# EasyEDA Pro project E-SportsV0.2-2.epro, schematic Schematic1
Board Name: Board1; Create Date: 2025-06-24; Page Name: P1; Project Name: E-SportsV0.2; Schematic Name: Schematic1; Update Date: 2025-06-26; Company: 嘉立创EDA; Page Size: A4; Version: V1.0
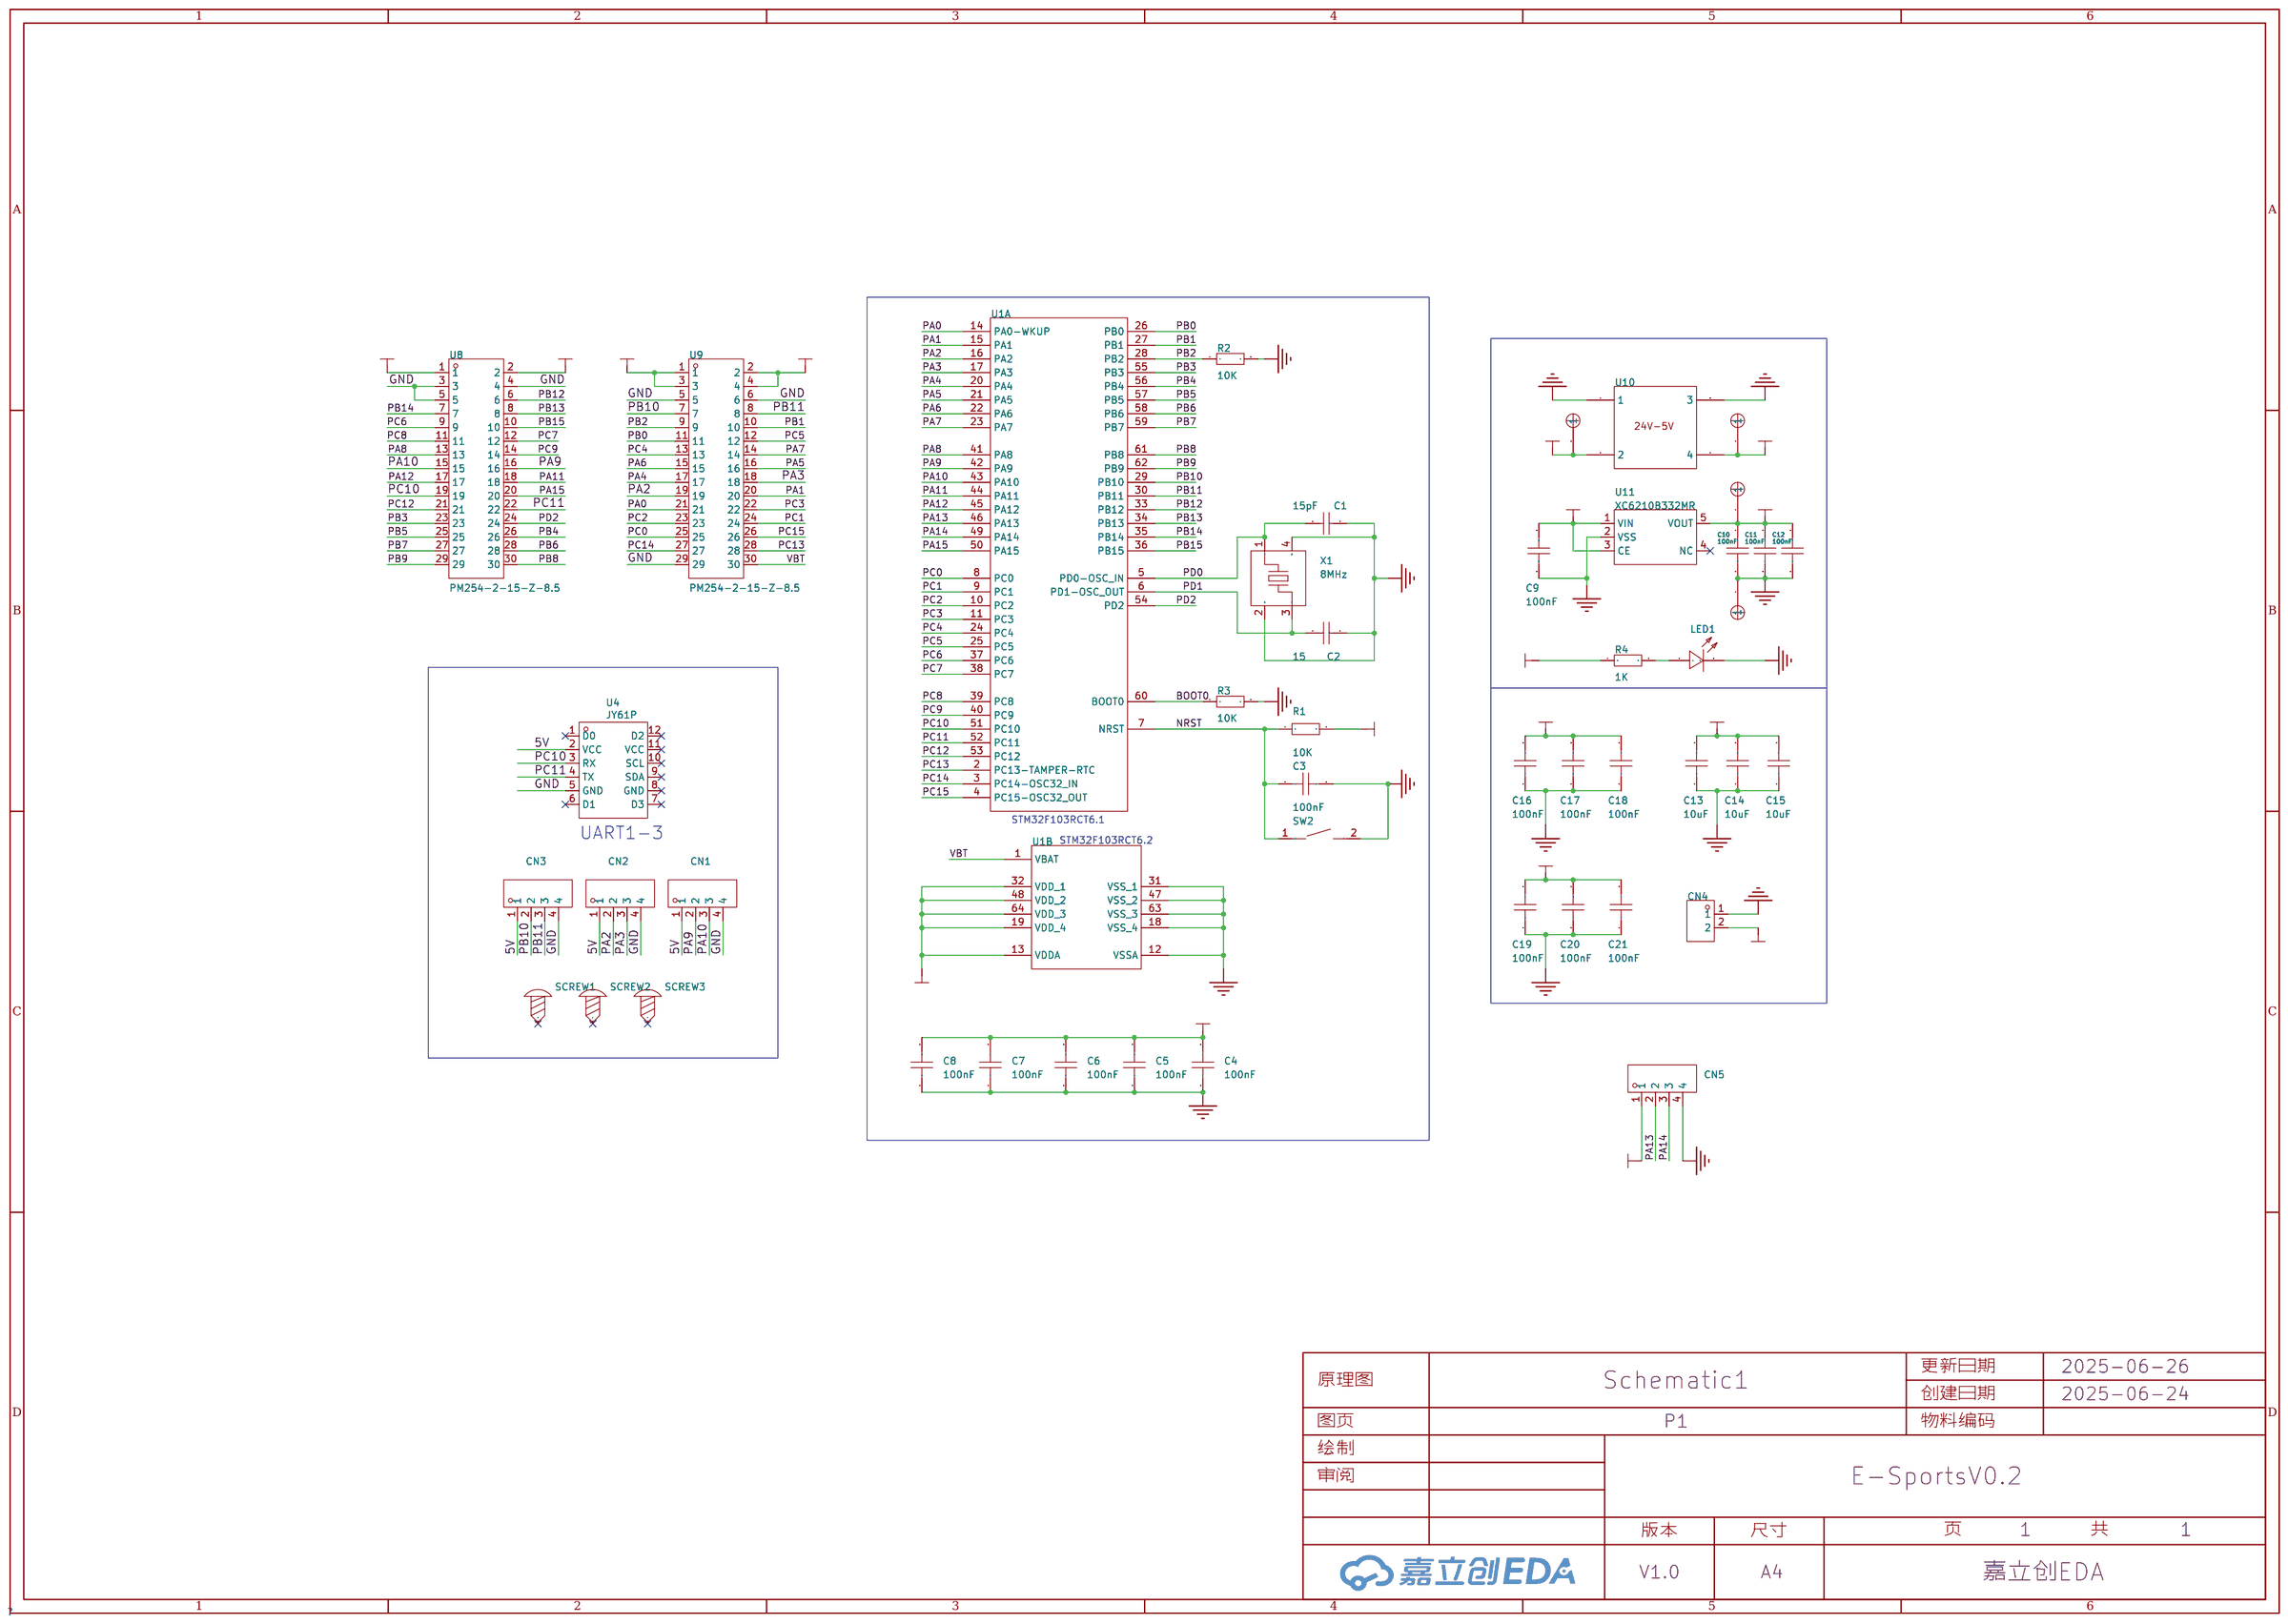
[diagram p2: schematic sheet]

## Parts
C1  15pF  [C0603]
C2  15  [C0603]
C3  100nF  [C0603]
C4  100nF  [C0603]
C5  100nF  [C0603]
C6  100nF  [C0603]
C7  100nF  [C0603]
C8  100nF  [C0603]
C9  100nF  [C0603]
C10  100nF  [C0603]
C11  100nF  [C0603]
C12  100nF  [C0603]
C13  10uF  [C0805]
C14  10uF  [C0805]
C15  10uF  [C0805]
C16  100nF  [C0603]
C17  100nF  [C0603]
C18  100nF  [C0603]
C19  100nF  [C0603]
C20  100nF  [C0603]
C21  100nF  [C0603]
CN1  ZX-XH2.54-4PWZ  [CONN-TH_4P-P2.50_ZX-XH2.54-4PWZ]
CN2  ZX-XH2.54-4PWZ  [CONN-TH_4P-P2.50_ZX-XH2.54-4PWZ]
CN3  ZX-XH2.54-4PWZ  [CONN-TH_4P-P2.50_ZX-XH2.54-4PWZ]
CN4  DB2ERC-3.81-2P-GN  [CONN-TH_2P-P3.81_DB2ERC-3.81-2P]
CN5  ZX-XH2.54-4PWZ  [CONN-TH_4P-P2.50_ZX-XH2.54-4PWZ]
LED1  KT-0805W  [LED0805-R-RD]
R1  10K  [R0603]
R2  10K  [R0603]
R3  10K  [R0603]
R4  1K  [R0603]
SCREW1  -  [M3螺丝]
SCREW2  -  [M3螺丝]
SCREW3  -  [M3螺丝]
SW2  TS-1088-AR02016  [SW-SMD_L3.9-W3.0-P4.45]
U1  STM32F103RCT6TR  [LQFP-64_L10.0-W10.0-P0.50-LS12.0-BL]  (sections 1,2)
U4  JY61P  [JY61P-直插]
U8  PM254-2-15-Z-8.5  [HDR-TH_30P-P2.54-V-F-R2-C15-S2.54-2]
U9  PM254-2-15-Z-8.5  [HDR-TH_30P-P2.54-V-F-R2-C15-S2.54-2]
U10  -  [DCDC]
U11  XC6210B332MR  [TSOT-23-5_L2.9-W1.6-P0.95-LS2.8-BR]
U12  -  [测试焊点]
U13  -  [测试焊点]
U14  -  [测试焊点]
U15  -  [测试焊点]
X1  8MHz  [CRYSTAL-SMD_4P-L3.2-W2.5-BL]

## Library data of the parts
C1 C2 = 0603CG300J500NT: 容值:30pF;精度:±5%;额定电压:50V;温度系数:C0G;; LCSC Part Name: 30pF ±5% 50V; Supplier Part: C1658; Manufacturer: FH(风华); Supplier Footprint: 0603; JLCPCB Part Class: 基础库; Datasheet: https://atta.szlcsc.com/upload/public/pdf/source/20200305/C486355_26A10D38EF8C2A5C37091D0039909270.pdf; Supplier: LCSC; Tolerance: ±5%; Voltage Rating: 50V; Temperature Coefficient: C0G
C3-C12 C16-C21 = CAP_0603: Supplier Footprint: 0603
C13-C15 = CL21A106KAYNNNE_C15850: 容值:10uF;精度:±10%;额定电压:25V;材质(温度系数):X5R;; LCSC Part Name: 10uF ±10% 25V; Supplier Part: C15850; Manufacturer: SAMSUNG(三星); Manufacturer Part: CL21A106KAYNNNE; Supplier Footprint: 0805; JLCPCB Part Class: 基础库; Datasheet: https://atta.szlcsc.com/upload/public/pdf/source/20160218/1457707763339.pdf; Supplier: LCSC; Tolerance: ±10%; Voltage Rated: 25V; Temperature Coefficient: X5R
CN1-CN3 = ZX-XH2.54-4PWZ: link: https://atta.szlcsc.com/upload/public/pdf/source/20230619/825E28BFFB9F3B9EEDAD896C78D625B2.pdf; Supplier: LCSC; Supplier Part: C7429643; Manufacturer: Megastar(兆星); JLCPCB Part Class: Extended Part
CN4 = DB2ERC-3.81-2P-GN: 连接器类型:板端/插座-闭口;结构:1x2P;间距:3.81mm;颜色:绿色;安装方式:弯针;排数:1;每排PIN数:2;额定电流:10A;额定电压:250V;工作温度范围:-40℃~+105℃;; LCSC Part Name: 3.81mm 1x2P 排数:1 每排P数:2; Supplier Part: C395684; Manufacturer: DORABO(地博电气); Supplier Footprint: 弯插,P=3.81mm; JLCPCB Part Class: 扩展库; Datasheet: https://atta.szlcsc.com/upload/public/pdf/source/20221115/4E217E7D538220F8720C137D6A05E519.pdf; Supplier: LCSC; Connector Type: 板端/插座-闭口; Structure: 1x2P; Pitch: 3.81mm; Color: 绿色; Mounting Style: 弯针; Number of Pins: 2P; Number of Rows: 1; Number of PINs Per Row: 2; Current Rating (Max): 10A; Voltage Rating (Max): 250V; Operating Temperature Range: -40℃~+105℃
CN5 = ZX-XH2.54-4PWZ: 插针结构:1x4P;间距:2.5mm;安装方式:弯插;参考系列:XH;总PIN数:4P;排数:1;每排PIN数:4;行距:-;额定电流:3A;触头材质:黄铜;触头镀层:锡;工作温度范围:-25℃~+85℃;; LCSC Part Name: 1x4P 间距:2.5mm 弯插 系列:XH; Supplier Part: C7429643; Manufacturer: Megastar(兆星); Supplier Footprint: 弯插,P=2.5mm; JLCPCB Part Class: 扩展库; Datasheet: https://atta.szlcsc.com/upload/public/pdf/source/20230619/8DC602C7BA46C153FF1BE89D90453879.pdf; Supplier: LCSC; Pins Structure: 1x4P; Pitch: 2.5mm; Mounting Type: 弯插; Reference Series: XH; Number of Pins: 4P; Number of Rows: 1; Number of PINs Per Row: 4; Rated Current: 3A; Contact Material: 黄铜; Contact Plating: 锡; Operating Temperature: -25℃~+85℃; Rated Voltage (Max): 250V; Plastic Material: PA66; Flame Retardant Rating: UL94V-0; Color: 白色; Z-Height of the Board: 5.9mm; X-Length of Bottom Edge on Board (Spacing Line): 12.5mm; Y-Width of Bottom Edge on Board: 7.32mm
LED1 = KT-0805W: 色温6000K左右; LCSC Part Name: 0805 白灯 高亮; Supplier Part: C34499; Manufacturer: KENTO; Supplier Footprint: 0805; JLCPCB Part Class: 基础库; Datasheet: https://atta.szlcsc.com/upload/public/pdf/source/20221124/DAA20402FFC1FB071B8B6797757426FE.pdf; Supplier: LCSC
R1-R4 = Res_0603: Supplier Footprint: 0603
SCREW1-SCREW3 = M3螺丝: Supplier Footprint: 插件
SW2 = TS-1088-AR02016: 电路结构:单刀单掷;按钮形状:圆形按钮;作用力:160gf;安装方式:立贴;开关长度:4mm;开关宽度:3mm;开关高度:2mm;带支架:不带;触点电流:50mA;额定电压(DC):12V;绝缘电阻:100MΩ;机械寿命:10万次;; LCSC Part Name: 4*3*2mm 立贴 轻触开关; Supplier Part: C720477; Manufacturer: XUNPU(讯普); Supplier Footprint: SMD; JLCPCB Part Class: 基础库; Datasheet: https://atta.szlcsc.com/upload/public/pdf/source/20200810/C720475_60D09DD6C54279ADDB2DC25100F1CC11.pdf; Supplier: LCSC; Circuit: 单刀单掷; Actuator Style: 圆形按钮; Operating Force: 160gf; Mounting Style: 立贴; Switch Length: 4mm; Switch Width: 3mm; Switch Height: 2mm; Strike Gundam: 不带; Contact Current: 50mA; Voltage Rating (DC): 12V; Insulation Resistance: 100MΩ; Actuator/Cap Color: 黑色; Pin Style: SMD接片; Mechanical Life: 10万次; Operating Temperature: -30℃~+80℃
U1 = STM32F103RCT6TR: CPU内核:ARM-M3;应用领域:-;; LCSC Part Name: 主流增强型ARM Cortex-M3 MCU，具有256 KB Flash、72 MHz CPU、电机控制、USB和CAN; Supplier Part: C39704; Manufacturer: ST(意法半导体); Supplier Footprint: LQFP-64(10x10); JLCPCB Part Class: 扩展库; Datasheet: https://atta.szlcsc.com/upload/public/pdf/source/20151012/1457707442737.pdf; Supplier: LCSC; CPU Core: ARM-M3; Program Storage Size: 256KB; Program Memory Type: FLASH; ADC (Bit): 12bit; DAC (Bit): 12bit
U4 = JY61P: Supplier: Wit-Motion
U8 U9 = PM254-2-15-Z-8.5: 插孔结构:2x15P;间距:2.54mm;行距:2.54mm;圆孔/方孔:方孔;安装类型:直插;排数:双排;总孔位数:30P;额定电流:3A;额定电压:-;插孔方向:顶部;塑高:8.5mm;触头材质:铜合金;工作温度范围:-40℃~+105℃;焊接温度(最大值):260℃@5S;; LCSC Part Name: 2x15P 间距:2.54mm 直插; Supplier Part: C2897416; Manufacturer: HCTL(华灿天禄); Supplier Footprint: 插件,P=2.54mm; JLCPCB Part Class: 扩展库; Datasheet: https://atta.szlcsc.com/upload/public/pdf/source/20230609/3D36CA2C1BFC9FD1C3F709AD9DFEB9C2.pdf; Supplier: LCSC; Holes Structure: 2x15P; Pitch: 2.54mm; Row Spacing: 2.54mm; Circular Hole / Square Hole: 方孔; Mounting Type: 直插; Number of Rows: 双排; Number of Holes: 30P; Current Rating (Max): 3A; Holes Direction: 顶部; Insulation Height: 8.5mm; Contact Material: 铜合金; Operating Temperature Range: -40℃~+105℃; Soldering Temperature(Max): 260℃@5S
U10 = DCDC24V-5V
U11 = XC6210B332MR_C424705: 输出类型:固定;工作电压:6V;输出电压:3.3V;输出电流:900mA;电源纹波抑制比(PSRR):60dB@(1kHz);输出极性:正极;; LCSC Part Name: 输入6V 输出3.3V 900mA; Supplier Part: C424705; Manufacturer: TOREX(特瑞仕); Supplier Footprint: SOT-25; JLCPCB Part Class: 扩展库; Datasheet: https://atta.szlcsc.com/upload/public/pdf/source/20200117/C484291_06FA0404E400374A8BAFCC9C6533AE86.pdf; Supplier: LCSC; Output Type: 固定; Voltage - Supply: 6V; Output Voltage: 3.3V; Output Current: 900mA; Power Supply Rejection Ratio (PSRR): 60dB@(1kHz); Voltage Dropout: 75mV@(100mA); Features: 低ESR；过流保护(OCP)；带使能; Output Configuration: 正极; Number of Outputs: 1
U12-U15 = 焊点
X1 = X32258MOB4SI: 晶振类型:贴片晶振;频率:8MHz;常温频差:±10ppm;负载电容:12pF;频率稳定度:±20ppm;; LCSC Part Name: YSX321SL 8MHZ 4P 3225 12PF ±10PPM -40~85℃ (±20PPM); Supplier Part: C2682775; Manufacturer: YXC(扬兴晶振); Supplier Footprint: SMD3225-4P; JLCPCB Part Class: 扩展库; Datasheet: https://atta.szlcsc.com/upload/public/pdf/source/20240329/19D5F850207469550BEB00D7DFEDBC7A.pdf; Supplier: LCSC; Type: 贴片晶振; Normal temperature Frequency Tolerance: ±10ppm; Load Capacitance: 12pF; Frequency Stability: ±20ppm; Equivalent Series Resistance(ESR): 150Ω; Operating Temperature: -40℃~+85℃

## Nets
3V3: C4.2 C5.2 C6.2 C7.2 C8.2 C10.1 C11.1 C12.1 C16.2 C17.2 C18.2 CN5.1 R1.2 R4.1 U1.13(VDDA) U1.19(VDD_4) U1.32(VDD_1) U1.48(VDD_2) U1.64(VDD_3) U9.1 U9.2 U9.3 U9.4 U11.5(VOUT) U13.1
5V: C9.1 C19.2 C20.2 C21.2 CN1.1 CN2.1 CN3.1 U4.2(VCC) U8.1 U8.2 U10.4 U11.1(VIN) U11.3(CE) U15.1
12V: C13.2 C14.2 C15.2 CN4.2 U10.2 U14.1
GND: C1.2 C2.2 C3.2 C4.1 C5.1 C6.1 C7.1 C8.1 C9.2 C10.2 C11.2 C12.2 C13.1 C14.1 C15.1 C16.1 C17.1 C18.1 C19.1 C20.1 C21.1 CN1.4 CN2.4 CN3.4 CN4.1 CN5.4 LED1.2(K) R2.2 R3.2 SW2.2 U1.12(VSSA) U1.18(VSS_4) U1.31(VSS_1) U1.47(VSS_2) U1.63(VSS_3) U4.5(GND) U8.3 U8.4 U8.5 U9.5 U9.6 U9.29 U10.1 U10.3 U11.2(VSS) U12.1 X1.2(GND) X1.4(GND)
BOOT0: R3.1 U1.60(BOOT0)
NRST: C3.1 R1.1 SW2.1 U1.7(NRST)
PA0: U1.14(PA0-WKUP) U9.21
PA1: U1.15(PA1) U9.20
PA2: CN2.2 U1.16(PA2) U9.19
PA3: CN2.3 U1.17(PA3) U9.18
PA4: U1.20(PA4) U9.17
PA5: U1.21(PA5) U9.16
PA6: U1.22(PA6) U9.15
PA7: U1.23(PA7) U9.14
PA8: U1.41(PA8) U8.13
PA9: CN1.2 U1.42(PA9) U8.16
PA10: CN1.3 U1.43(PA10) U8.15
PA11: U1.44(PA11) U8.18
PA12: U1.45(PA12) U8.17
PA13: CN5.2 U1.46(PA13)
PA14: CN5.3 U1.49(PA14)
PA15: U1.50(PA15) U8.20
PB0: U1.26(PB0) U9.11
PB1: U1.27(PB1) U9.10
PB2: R2.1 U1.28(PB2) U9.9
PB3: U1.55(PB3) U8.23
PB4: U1.56(PB4) U8.26
PB5: U1.57(PB5) U8.25
PB6: U1.58(PB6) U8.28
PB7: U1.59(PB7) U8.27
PB8: U1.61(PB8) U8.30
PB9: U1.62(PB9) U8.29
PB10: CN3.2 U1.29(PB10) U9.7
PB11: CN3.3 U1.30(PB11) U9.8
PB12: U1.33(PB12) U8.6
PB13: U1.34(PB13) U8.8
PB14: U1.35(PB14) U8.7
PB15: U1.36(PB15) U8.10
PC0: U1.8(PC0) U9.25
PC1: U1.9(PC1) U9.24
PC2: U1.10(PC2) U9.23
PC3: U1.11(PC3) U9.22
PC4: U1.24(PC4) U9.13
PC5: U1.25(PC5) U9.12
PC6: U1.37(PC6) U8.9
PC7: U1.38(PC7) U8.12
PC8: U1.39(PC8) U8.11
PC9: U1.40(PC9) U8.14
PC10: U1.51(PC10) U4.3(RX) U8.19
PC11: U1.52(PC11) U4.4(TX) U8.22
PC12: U1.53(PC12) U8.21
PC13: U1.2(PC13-TAMPER-RTC) U9.28
PC14: U1.3(PC14-OSC32_IN) U9.27
PC15: U1.4(PC15-OSC32_OUT) U9.26
PD0: C1.1 U1.5(PD0-OSC_IN) X1.1
PD1: C2.1 U1.6(PD1-OSC_OUT) X1.3
PD2: U1.54(PD2) U8.24
VBT: U1.1(VBAT) U9.30
$1N16607: LED1.1(A) R4.2

Not connected (* = marked no-connect by the designer): SCREW1 1*; SCREW2 1*; SCREW3 1*; U4 1(D0)* 6(D1)* 7(D3)* 8(GND)* 9(SDA)* 10(SCL)* 11(VCC)* 12(D2)*; U11 4(NC)*

## Notes on the sheet
- STM32F103RCT6.1
- UART1-3
- STM32F103RCT6.2
